# Altium project RFID-project.PrjPcb
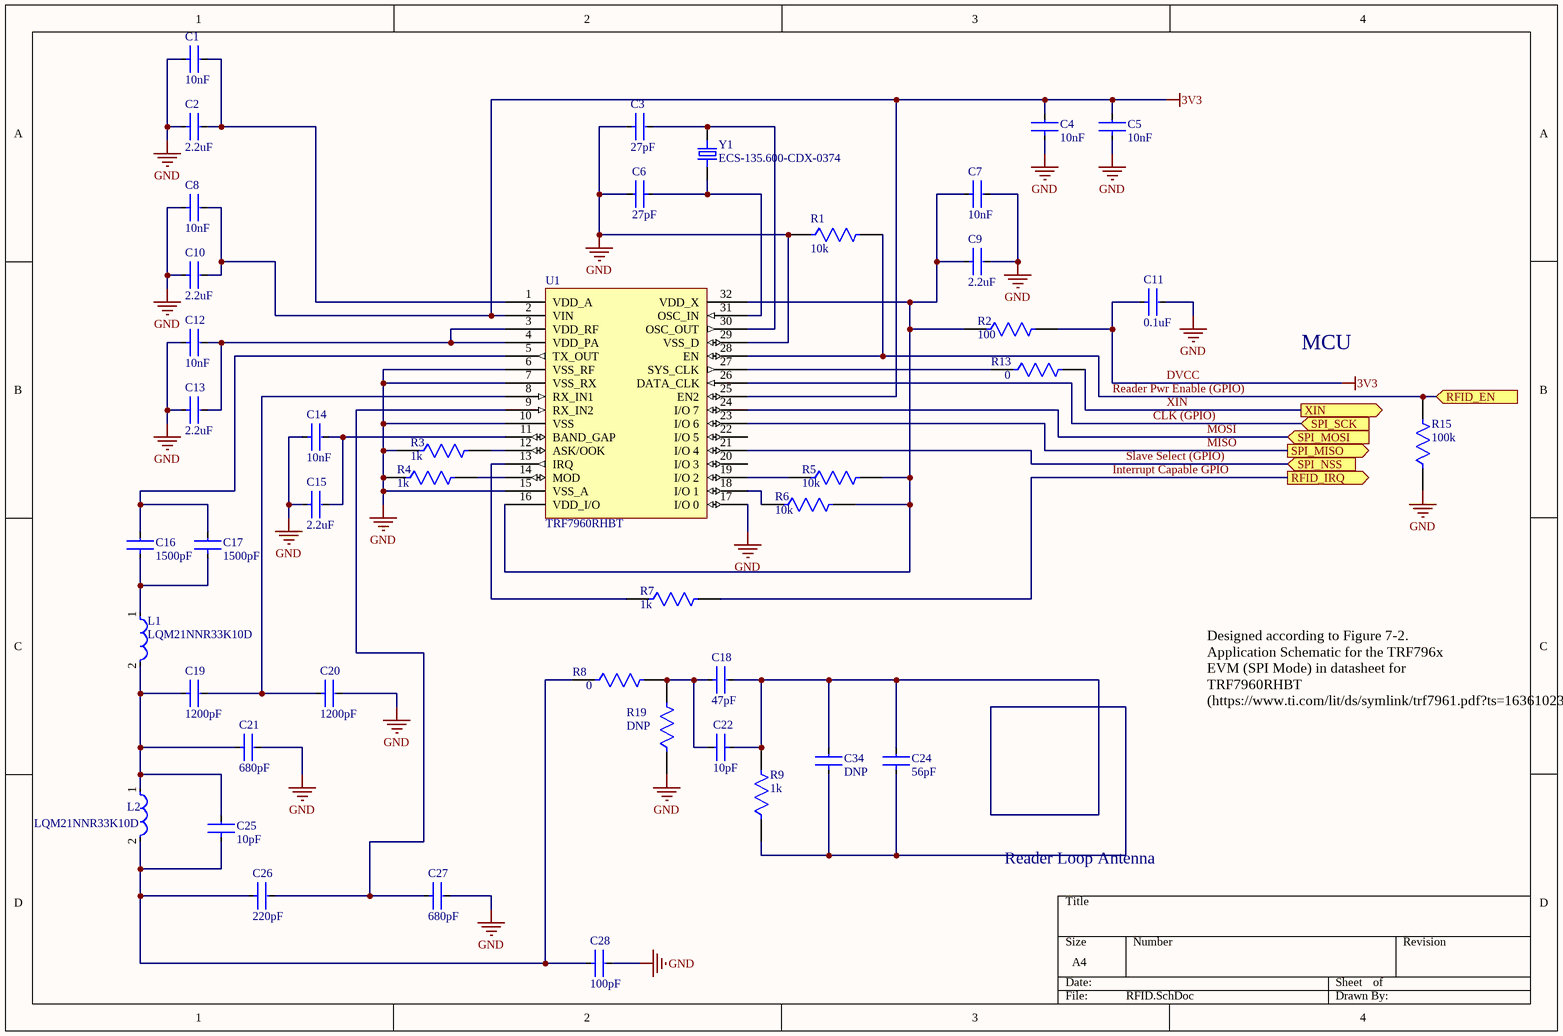
[diagram p0: RFID.SchDoc]
3 sheets, 85 parts. Net scope: flat (ports and power ports of the same name join across sheets).
Board file: RFID-PCB.PcbDoc
Sheets:
  RFID.SchDoc
  MCU.SchDoc
  Power.SchDoc

## Sheet RFID.SchDoc
size A4; SheetNumber: 1; SheetTotal: 3

### Parts
C1  10nF  [FP-GCJ21B-0_3-IPC_A]
C2  2.2uF  [FP-GCJ21B-0_3-IPC_A]
C3  27pF  [FP-GCJ21B-0_3-IPC_A]
C4  10nF  [FP-GCJ21B-0_3-IPC_A]
C5  10nF  [FP-GCJ21B-0_3-IPC_A]
C6  27pF  [FP-GCJ21B-0_3-IPC_A]
C7  10nF  [FP-GCJ21B-0_3-IPC_A]
C8  10nF  [FP-GCJ21B-0_3-IPC_A]
C9  2.2uF  [FP-GCJ21B-0_3-IPC_A]
C10  2.2uF  [FP-GCJ21B-0_3-IPC_A]
C11  0.1uF  [FP-GCJ21B-0_3-IPC_A]
C12  10nF  [FP-GCJ21B-0_3-IPC_A]
C13  2.2uF  [FP-GCJ21B-0_3-IPC_A]
C14  10nF  [FP-GCJ21B-0_3-IPC_A]
C15  2.2uF  [FP-GCJ21B-0_3-IPC_A]
C16  1500pF  [FP-GCJ21B-0_3-IPC_A]
C17  1500pF  [FP-GCJ21B-0_3-IPC_A]
C18  47pF  [FP-GCJ21B-0_3-IPC_A]
C19  1200pF  [FP-GCJ21B-0_3-IPC_A]
C20  1200pF  [FP-GCJ21B-0_3-IPC_A]
C21  680pF  [FP-GCJ21B-0_3-IPC_A]
C22  10pF  [FP-GCJ21B-0_3-IPC_A]
C24  56pF  [FP-GCJ21B-0_3-IPC_A]
C25  10pF  [FP-GCJ21B-0_3-IPC_A]
C26  220pF  [FP-GCJ21B-0_3-IPC_A]
C27  680pF  [FP-GCJ21B-0_3-IPC_A]
C28  100pF  [FP-GCJ21B-0_3-IPC_A]
C34  DNP  [FP-GCJ21B-0_3-IPC_A]
L1  LQM21NNR33K10D  [FP-LQM21DN_00-IPC_A]
L2  LQM21NNR33K10D  [FP-LQM21DN_00-IPC_A]
R1  10k  [FP-AC0603-MFG]
R2  100  [FP-AC0603-MFG]
R3  1k  [FP-AC0603-MFG]
R4  1k  [FP-AC0603-MFG]
R5  10k  [FP-AC0603-MFG]
R6  10k  [FP-AC0603-MFG]
R7  1k  [FP-AC0603-MFG]
R8  0  [FP-AC0603-MFG]
R9  1k  [FP-AC0603-MFG]
R13  0  [FP-AC0603-MFG]
R15  100k  [FP-AC0603-MFG]
R19  DNP  [FP-AC0603-MFG]
U1  TRF7960RHBT  [IC_ADS125H01IRHBT]
Y1  ECS-135.600-CDX-0374  [XTAL_ECS-135.600-CDX-0374]

### Ports
RFID_EN (in), RFID_IRQ (out), SPI_MISO (out), SPI_MOSI (in), SPI_NSS (in), SPI_SCK (in), XIN (out)

### Nets
DVCC: C4.2 C5.2 C8.2 C10.2 C11.1 R2.2 U1.2(VIN) U1.25(EN2)  [also labelled 3V3]
GND: C1.1 C2.1 C3.1 C4.1 C5.1 C6.2 C7.2 C8.1 C9.2 C10.1 C11.2 C12.1 C13.1 C14.1 C15.1 C20.2 C21.2 C27.2 C28.2 R1.1 R3.1 R4.1 R15.1 R19.1 U1.6(VSS_RF) U1.7(VSS_RX) U1.10(VSS) U1.15(VSS_A) U1.17(I/O_0) U1.29(VSS_D)
CLK (GPIO): U1.26(DATA_CLK) ; port SPI_SCK
Interrupt Capable GPIO: R7.2 ; port RFID_IRQ
MISO: U1.23(I/O_6) ; port SPI_MISO
MOSI: U1.24(I/O_7) ; port SPI_MOSI
Reader Pwr Enable (GPIO): R1.2 R15.2 U1.28(EN) ; port RFID_EN
Slave Select (GPIO): U1.21(I/O_4) ; port SPI_NSS
XIN: R13.2 ; port XIN
NetC1_2: C1.2 C2.2 U1.1(VDD_A)
NetC3_2: C3.2 U1.30(OSC_OUT) Y1.2
NetC6_1: C6.1 U1.31(OSC_IN) Y1.1
NetC7_1: C7.1 C9.1 R2.1 R5.2 R6.2 U1.16(VDD_I/O) U1.32(VDD_X)
NetC12_2: C12.2 C13.2 U1.3(VDD_RF) U1.4(VDD_PA)
NetC14_2: C14.2 C15.2 U1.11(BAND_GAP)
NetC16_1: C16.1 C17.1 L1.1
NetC16_2: C16.2 C17.2 U1.5(TX_OUT)
NetC18_1: C18.1 C22.2 R8.2 R19.2
NetC18_2: C18.2 C22.1 C24.1 C24.2 C34.1 C34.2 R9.1 R9.2
NetC19_1: C19.1 C21.1 C25.2 L1.2 L2.1
NetC19_2: C19.2 C20.1 U1.8(RX_IN1)
NetC25_1: C25.1 C26.1 C28.1 L2.2 R8.1
NetC26_2: C26.2 C27.1 U1.9(RX_IN2)
NetR3_2: R3.2 U1.12(ASK/OOK)
NetR4_2: R4.2 U1.14(MOD)
NetR5_1: R5.1 U1.19(I/O_2)
NetR6_1: R6.1 U1.18(I/O_1)
NetR7_1: R7.1 U1.13(IRQ)
NetR13_1: R13.1 U1.27(SYS_CLK)

Not connected (* = marked no-connect by the designer): U1 20(I/O_3) 22(I/O_5)

### Notes on the sheet
- MCU
- Designed according to Figure 7-2. Application Schematic for the TRF796x EVM (SPI Mode) in datasheet for TRF7960RHBT               (https://www.ti.com/lit/ds/symlink/trf7961.pdf?ts=1636102370290&ref_url=https%253A%252F%252Fwww.google.com%252F)
- Reader Loop Antenna

### Library data of the parts
C1-C22 C24-C28 C34 = CMP-2007-03210-2: Multilayer Ceramic Capacitors MLCC - SMD/SMT 0805 2.2uF 10%, 16VDC,  X7R 15%; Voltage Rating (DC): 16V; Thickness: 0.057inch; Lead Free: Lead Free; Dielectric: X7R; Case Code (Imperial): 0805; Packaging: Tape and Reel; Features: Soft Termination; Termination: SMD/SMT; Height: 1.25mm; Radiation Hardening: No; Capacitance: 2.2uF; Package Quantity: 1; Min Operating Temperature: -55°C; Ratings: AEC-Q200; Voltage Rating: 16V; Case/Package: 0805; Max Operating Temperature: 125°C; Depth: 1.25mm; Tolerance: 10%; Case Code (Metric): 2012; Length: 2mm; Mount: Surface Mount; Width: 0.049inch
L1 L2 = CMP-06042-017039-1: Multilayer Type Inductor for General Circuits, 0805 (2012), 0.33μH, 10%, 0.48Ω, 250mA; DC Resistance (DCR): 480mR; Self Resonant Frequency: 180MHz; Q Factor: 20; Core Material: Ferrite; Inductance: 330nH; Shielding: Shielded; Test Frequency: 25MHz; Max DC Current: 250mA; Number of Pins: 2; Mount: Surface Mount; Case/Package: 0805; Case Code (Metric): 2012; Min Operating Temperature: -40°C; Package Quantity: 4000; DC Current: 250mA; Max Operating Temperature: 85°C; Height - Seated (Max): 0.041inch; REACH SVHC: No SVHC; Radiation Hardening: No; Current Rating: 250mA; Length: 2mm; Depth: 1.45mm; Height: 0.85mm; Packaging: Tape and Reel; Inductance Tolerance: 10%; Case Code (Imperial): 0805; Series: LQM21N; Military Standard: Not; Width: 0.049inch; RoHS Compliant: Yes; Termination: SMD/SMT; Tolerance: 10%
R1-R9 R13 R15 R19 = CMP-03412-025180-1: RES SMD 60.4 OHM 1% 1/10W 0603; Manufacturer Part Number: AC0603FR-0760R4L; Manufacturer: Yageo; Automotive Grade: Grade 0; Value: 60.4Ω; Power Rating: 0.1W; Voltage Rating: 75V; Tolerance: 0.01; Automotive: Yes; Category: Res; Mouser Description: Res Thick Film 0603 60.4 Ohm 1% 0.1W(1/10W) ±100ppm/C Epoxy Pad SMD Automotive T/R; Height: 0.55mm; Temperature: -55°C to +155°C; Resistance: 60.4Ω; Package: AC0603; Device Class L3: Chip SMD Resistors; ComponentLink2URL: http://www.yageo.com/NewPortal/yageodocoutput?fileName=/pdf/R-Chip/PYu-AC_51_RoHS_L_6.pdf; Composition: Thick Film; Octopart: https://octopart.com/ac0603fr-0760r4l-yageo-71367350; Temperature Range Low: -55°C; Lead Free: Yes; Footprint Url: http://www.yageo.com/exep/pages/download/literatures/PYu-R_Mount_9.pdf; ComponentLink2Description: Datasheet; Series: AC; Device Class L1: Passive Components; Device Class L2: Resistors; Temperature Range High: +155°C; RoHS: TRUE; Digikey Description: RES SMD 60.4 OHM 1% 1/10W 0603; Ipc Land Pattern Name: RESC16080X45
U1 = TRF7960RHBT: TRF7960 Multi-Protocol Fully Integrated 13.56-MHz RFID Reader/Writer IC 32-VQFN -40 to 110
Y1 = ECS-135.600-CDX-0374: Package: None; Price: None; Value: *; MP: ECS-135.600-CDX-0374; Availability: Unavailable

## Sheet MCU.SchDoc
size A4; SheetNumber: 2; SheetTotal: 3
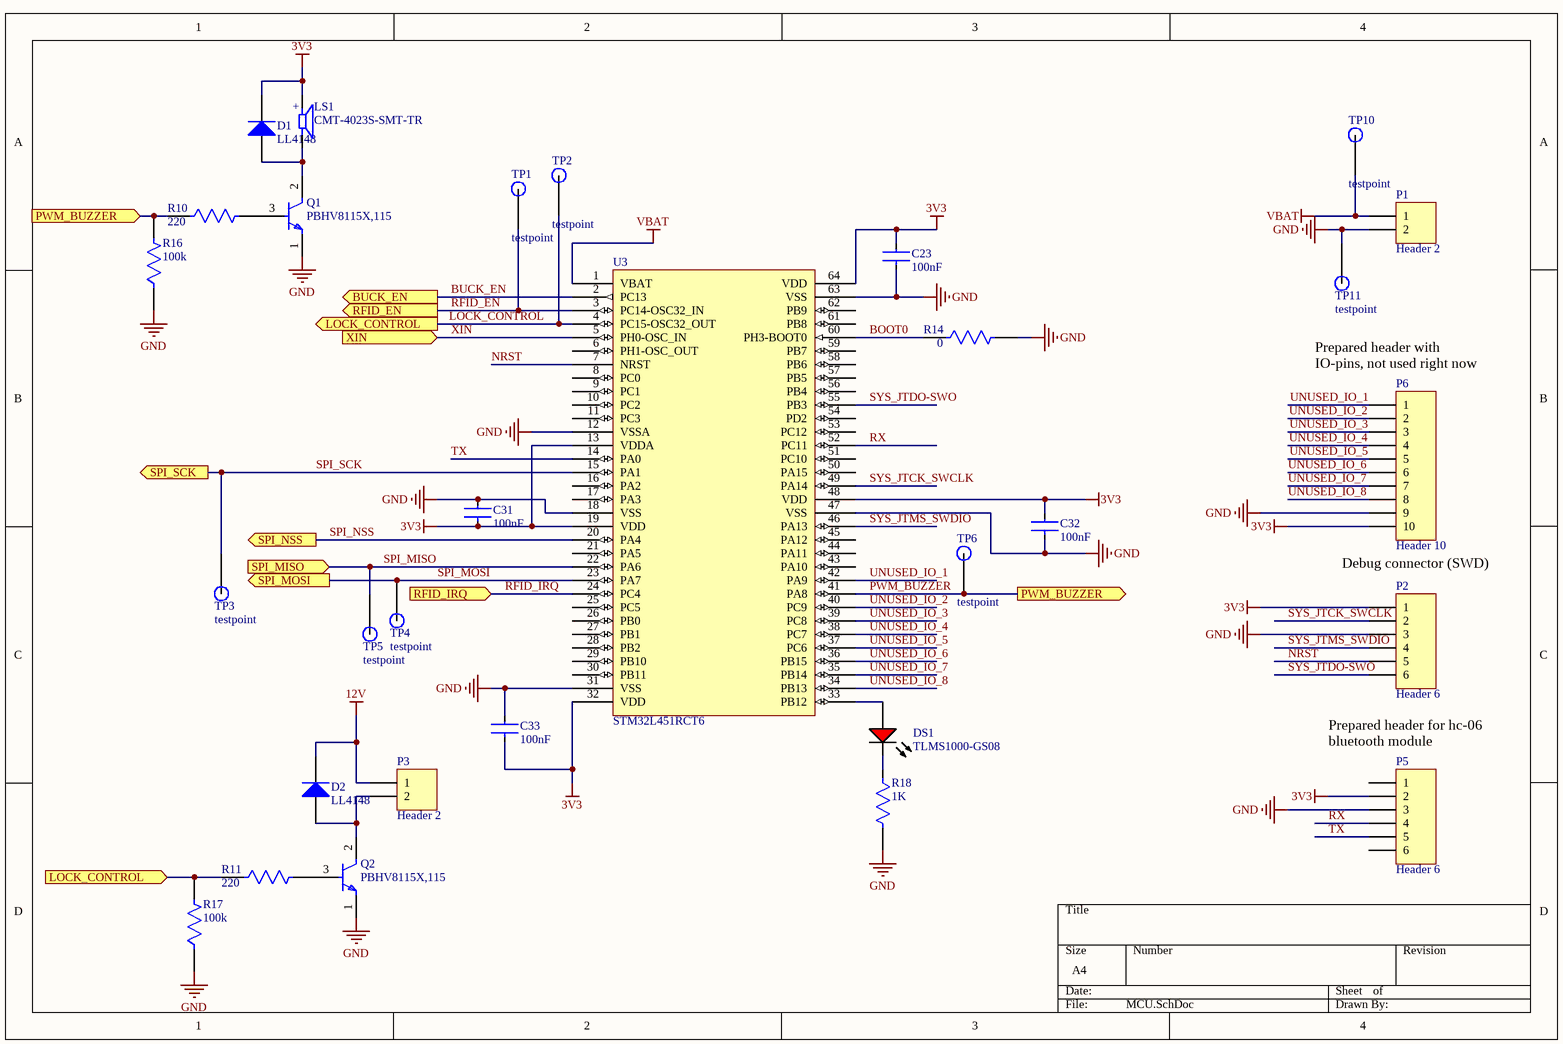
[diagram p1: MCU.SchDoc]

### Parts
C23  100nF  [FP-GCJ21B-0_3-IPC_A]
C31  100nF  [FP-GCJ21B-0_3-IPC_A]
C32  100nF  [FP-GCJ21B-0_3-IPC_A]
C33  100nF  [FP-GCJ21B-0_3-IPC_A]
D1  LL4148  [FAIR-SOD80-2_V]
D2  LL4148  [FAIR-SOD80-2_V]
DS1  TLMS1000-GS08  [VISH-TLMS1000_V]
LS1  CMT-4023S-SMT-TR  [CUI_CMT-4023S-SMT-TR]
P1  Header 2  [HDR1X2]
P2  Header 6  [HDR1X6]
P3  Header 2  [HDR1X2]
P5  Header 6  [HDR1X6]
P6  Header 10  [HDR1X10]
Q1  PBHV8115X,115  [FP-SOT89-MFG]
Q2  PBHV8115X,115  [FP-SOT89-MFG]
R10  220  [FP-AC0603-MFG]
R11  220  [FP-AC0603-MFG]
R14  0  [FP-AC0603-MFG]
R16  100k  [FP-AC0603-MFG]
R17  100k  [FP-AC0603-MFG]
R18  1K  [FP-AC0603-MFG]
TP1  testpoint  [Testpoint]
TP2  testpoint  [Testpoint]
TP3  testpoint  [Testpoint]
TP4  testpoint  [Testpoint]
TP5  testpoint  [Testpoint]
TP6  testpoint  [Testpoint]
TP10  testpoint  [Testpoint]
TP11  testpoint  [Testpoint]
U3  STM32L451RCT6  [LQFP-64]

### Ports
BUCK_EN (out), LOCK_CONTROL (in), LOCK_CONTROL (out), PWM_BUZZER (in), PWM_BUZZER (out), RFID_EN (out), RFID_IRQ (in), SPI_MISO (in), SPI_MOSI (out), SPI_NSS (out), SPI_SCK (out), XIN (in)

### Nets
3V3: C23.2 C31.1 C32.2 C33.1 D1.2(K) LS1.P P2.1 P5.2 P6.10 U3.13(VDDA) U3.19(VDD) U3.32(VDD) U3.48(VDD) U3.64(VDD)  [project net DVCC]
12V: D2.2(K) P3.1
GND: C23.1 C31.2 C32.1 C33.2 P1.2 P2.3 P5.3 P6.9 Q1.1(E) Q2.1(E) R14.2 R16.1 R17.1 R18.2 TP11.1(tp) U3.12(VSSA) U3.18(VSS) U3.31(VSS) U3.47(VSS) U3.63(VSS)
VBAT: P1.1 TP10.1(tp) U3.1(VBAT)
BOOT0: R14.1 U3.60(PH3-BOOT0)
BUCK_EN: U3.2(PC13) ; port BUCK_EN
LOCK_CONTROL: R11.1 R17.2 TP2.1(tp) U3.4(PC15-OSC32_OUT) ; port LOCK_CONTROL
NRST: P2.5 U3.7(NRST)
PWM_BUZZER: R10.1 R16.2 TP6.1(tp) U3.41(PA8) ; port PWM_BUZZER
RFID_EN: TP1.1(tp) U3.3(PC14-OSC32_IN) ; port RFID_EN  [project net Reader Pwr Enable (GPIO)]
RFID_IRQ: U3.24(PC4) ; port RFID_IRQ  [project net Interrupt Capable GPIO]
RX: P5.4 U3.52(PC11)
SPI_MISO: TP5.1(tp) U3.22(PA6) ; port SPI_MISO  [project net MISO]
SPI_MOSI: TP4.1(tp) U3.23(PA7) ; port SPI_MOSI  [project net MOSI]
SPI_NSS: U3.20(PA4) ; port SPI_NSS  [project net Slave Select (GPIO)]
SPI_SCK: TP3.1(tp) U3.15(PA1) ; port SPI_SCK  [project net CLK (GPIO)]
SYS_JTCK_SWCLK: P2.2 U3.49(PA14)
SYS_JTDO-SWO: P2.6 U3.55(PB3)
SYS_JTMS_SWDIO: P2.4 U3.46(PA13)
TX: P5.5 U3.14(PA0)
UNUSED_IO_1: P6.1 U3.42(PA9)
UNUSED_IO_2: P6.2 U3.40(PC9)
UNUSED_IO_3: P6.3 U3.39(PC8)
UNUSED_IO_4: P6.4 U3.38(PC7)
UNUSED_IO_5: P6.5 U3.37(PC6)
UNUSED_IO_6: P6.6 U3.36(PB15)
UNUSED_IO_7: P6.7 U3.35(PB14)
UNUSED_IO_8: P6.8 U3.34(PB13)
XIN: U3.5(PH0-OSC_IN) ; port XIN
NetD1_1: D1.1(A) LS1.N Q1.2(C)
NetD2_1: D2.1(A) P3.2 Q2.2(C)
NetDS1_1: DS1.1(A) U3.33(PB12)
NetDS1_2: DS1.2(K) R18.1
NetQ1_3: Q1.3(B) R10.2
NetQ2_3: Q2.3(B) R11.2

Not connected (* = marked no-connect by the designer): P5 1 6; U3 6(PH1-OSC_OUT) 8(PC0) 9(PC1) 10(PC2) 11(PC3) 16(PA2) 17(PA3) 21(PA5) 25(PC5) 26(PB0) 27(PB1) 28(PB2) 29(PB10) 30(PB11) 43(PA10) 44(PA11) 45(PA12) 50(PA15) 51(PC10) 53(PC12) 54(PD2) 56(PB4) 57(PB5) 58(PB6) 59(PB7) 61(PB8) 62(PB9)

### Notes on the sheet
- (near P6) Prepared header with IO-pins, not used right now
- Debug connector (SWD)
- Prepared header for hc-06 bluetooth module
- (in symbol CMT-4023S-SMT-TR) +

### Library data of the parts
C23 C31-C33 = CMP-2007-03210-2: as C1 on sheet RFID; Thickness: 0.057inch; Lead Free: Lead Free; Dielectric: X7R; Case Code (Imperial): 0805; Packaging: Tape and Reel; Features: Soft Termination; Termination: SMD/SMT; Height: 1.25mm; Radiation Hardening: No; Capacitance: 2.2uF; Package Quantity: 1; Min Operating Temperature: -55°C; Ratings: AEC-Q200; Voltage Rating: 16V; Case/Package: 0805; Max Operating Temperature: 125°C; Depth: 1.25mm; Tolerance: 10%; Case Code (Metric): 2012; Length: 2mm; Mount: Surface Mount; Width: 0.049inch
D1 D2 = CMP-2000-05115-2: Small Signal Diode, 100 V, 0.2 A, -55 to 175 degC, 2-Pin SOD80, RoHS, Tape and Reel; Manufacturer: Fairchild; Reverse Voltage-Max [Vrrm]: 100V; Average Forward Current-Max: 200mA; Forward Voltage: 1V; Reverse Recovery Time-Max: 1ns; Power Dissipation: 500mW; Datasheet URL: https://www.fairchildsemi.com/datasheets/LL/LL4148.pdf; Manufacturer URL: https://www.fairchildsemi.com/; Datasheet Version: Rev. 1.8, 01/2016
DS1 = CMP-2000-07254-1: Low Current LED, 40 mW, 1.8 V, -40 to 100 degC, 2-Pin SMD (0603), RoHS, Tape and Reel; Manufacturer: Vishay; Lens Shape: Rectangular; Automotive Qualification Standard: AEC-Q100; Wavelength Typ: 636nm; SVHC: ToBeAdvised; LED Colour: Red; Bulb Size: 1.6mmx0.8mm; Forward Voltage: 1.8V; Luminous Intensity: 4mcd; Forward Current If: 2mA; Viewing Angle: 80°; Datasheet Version: Rev. 1.7, 02/2011; Datasheet URL: https://datasheet.ciiva.com/5798/1698881-5798337.pdf; LED Mounting: SMD; Packaging: CutTape; Package Reference: TLMS1000; Manufacturer URL: http://www.vishay.com/; Mounting Technology: SurfaceMount; Product Range: -; Package Description: 2-Pin Surface Mount Device, Body 1.6 x 0.8 mm; MSL: MSL2-1year
LS1 = CMT-4023S-SMT-TR: 4 mm, 3 Vo-p, 70 dB, Surface Mount _SMT_, Magnetic Audio Transducer Buzzer; MF: CUI Devices; Value: *; Availability: Unavailable; Package: SIP-1 CUI; Price: None; SnapEDA_Link: https://www.snapeda.com/parts/CMT-4023S-SMT-TR/CUI%20Devices/view-part/612102/?ref=snap; MP: CMT-4023S-SMT-TR; CUI_purchase_URL: https://www.cuidevices.com/product/audio/buzzers/audio-transducers/cmt-4023s-smt-tr?utm_source=snapeda.com&utm_medium=referral&utm_campaign=snapedaBOM
P1 P3 = Header 2: Header, 2-Pin; LatestRevisionDate: 17-Jul-2002; LatestRevisionNote: Re-released for DXP Platform.; Publisher: Altium Limited
P2 P5 = Header 6: Header, 6-Pin; LatestRevisionDate: 17-Jul-2002; LatestRevisionNote: Re-released for DXP Platform.; Publisher: Altium Limited
P6 = Header 10: Header, 10-Pin; LatestRevisionDate: 17-Jul-2002; LatestRevisionNote: Re-released for DXP Platform.; Publisher: Altium Limited
Q1 Q2 = CMP-14406-000018-1: TRANS NPN 150V 1A SOT89; Manufacturer: Nexperia; Number Of Npn: 1; Rise Time Tr: 565ns; Delay Time Td: 7ns; Rthja Max: 240K/W; Emitter Base Voltage: 6V; Hfe Testvce: 10V; Collector Emitter Saturation Voltage: 33mV; Hfe Min: 10; Max Junction Temp: +150°C; Gain Bandwidth Product: 30MHz; Automotive Grade: Grade 0; Power Dissipation: 0.52W; Collector Base Voltage: 400V; Fall Time Tf: 700ns; Category: Trans; Lead Free: Yes; Number Of Elements: 1; Ambient Temperature Range Low: -55°C; Height: 1.6mm; Temperature: to +150°C; Max Collector Current: 1A; Manufacturer Part Number: PBHV8115X,115; Device Class L3: BJTs; ComponentLink2URL: https://assets.nexperia.com/documents/data-sheet/PBHV8115X.pdf; Collector Emitter Voltage: 150V; Device Class L1: Discrete Semiconductors; Package: SOT89; Storage Time Ts: 1530ns; Ambient Temperature Range High: +150°C; Digikey Description: TRANS NPN 150V 1A SOT89; ComponentLink2Description: Datasheet; Footprint Url: https://assets.nexperia.com/documents/outline-drawing/SOT89.pdf; Device Class L2: Transistors; RoHS: TRUE; Automotive: Yes; Temperature Range High: +150°C; Octopart: https://octopart.com/pbhv8115x%2C115-nexperia-78740688; Hfe Testic: 1A
R10 R11 R14 R16-R18 = CMP-03412-025180-1: as R1 on sheet RFID; Automotive: Yes; Category: Res; Mouser Description: Res Thick Film 0603 60.4 Ohm 1% 0.1W(1/10W) ±100ppm/C Epoxy Pad SMD Automotive T/R; Height: 0.55mm; Temperature: -55°C to +155°C; Resistance: 60.4Ω; Package: AC0603; Device Class L3: Chip SMD Resistors; ComponentLink2URL: http://www.yageo.com/NewPortal/yageodocoutput?fileName=/pdf/R-Chip/PYu-AC_51_RoHS_L_6.pdf; Composition: Thick Film; Octopart: https://octopart.com/ac0603fr-0760r4l-yageo-71367350; Temperature Range Low: -55°C; Lead Free: Yes; Footprint Url: http://www.yageo.com/exep/pages/download/literatures/PYu-R_Mount_9.pdf; ComponentLink2Description: Datasheet; Series: AC; Device Class L1: Passive Components; Device Class L2: Resistors; Temperature Range High: +155°C; RoHS: TRUE; Digikey Description: RES SMD 60.4 OHM 1% 1/10W 0603; Ipc Land Pattern Name: RESC16080X45
U3 = STM32L451RCT6: MCU 32-bit STM32; Manufacturer: STMicroelectronics; Manufacturer Part Number: STM32L451RCT6; RoHS: Yes; Category: Microcontrollers

## Sheet Power.SchDoc
size A4; SheetNumber: 3; SheetTotal: 3
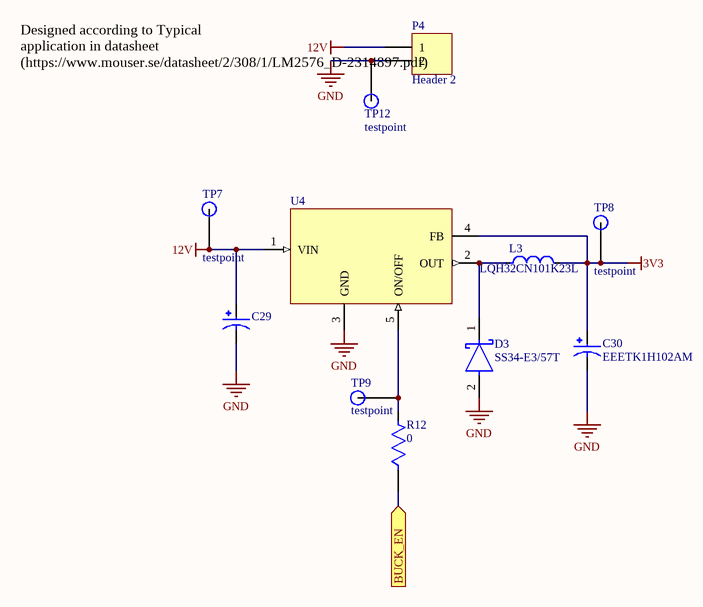
[diagram p2: Power.SchDoc]

### Parts
C29  EEETC1C101P  [CAP_EEETC1C101P]  (value not drawn)
C30  EEETK1H102AM  [CAP_EEETK1H102AM]
D3  SS34-E3/57T  [FP-95402-MFG]
L3  LQH32CN101K23L  [FP-LQH32CH_23-MFG]
P4  Header 2  [HDR1X2]
R12  0  [FP-AC0603-MFG]
TP7  testpoint  [Testpoint]
TP8  testpoint  [Testpoint]
TP9  testpoint  [Testpoint]
TP12  testpoint  [Testpoint]
U4  LM2576D2TR4-3.3G  [D2PAK-5]  (value not drawn)

### Ports
BUCK_EN (in)

### Nets
3V3: C30.1 L3.2 TP8.1(tp) U4.4(FB)  [project net DVCC]
12V: C29.1 P4.1 TP7.1(tp) U4.1(VIN)
GND: C29.2 C30.2 D3.2(A) P4.2 TP12.1(tp) U4.3(GND)
BUCK_EN: R12.1 ; port BUCK_EN
NetD3_1: D3.1(C) L3.1 U4.2(OUT)
NetR12_2: R12.2 TP9.1(tp) U4.5(ON/OFF)

### Notes on the sheet
- Designed according to Typical application in datasheet (https://www.mouser.se/datasheet/2/308/1/LM2576_D-2314897.pdf)

### Library data of the parts
C29 = EEETC1C101P: 100µF 16V Aluminum Electrolytic Capacitors Radial, Can - SMD 200mOhm @ 100kHz 3000 Hrs @ 125°C; MF: Panasonic; MP: EEETC1C101P; Package: RADIAL-2 Panasonic; Availability: In Stock; Value: *; SnapEDA_Link: https://www.snapeda.com/parts/EEETC1C101P/Panasonic/view-part/?ref=snap; Price: None; Check_prices: https://www.snapeda.com/parts/EEETC1C101P/Panasonic/view-part/?ref=eda
C30 = EEETK1H102AM: 1000µF 50V Aluminum Electrolytic Capacitors Radial, Can - SMD 140mOhm @ 100kHz 2000 Hrs @ 125°C; MF: Panasonic Electronic; MP: EEE-TK1H102AM; Availability: In Stock; Price: None; Package: RADIAL-2 Panasonic; SnapEDA_Link: https://www.snapeda.com/parts/EEE-TK1H102AM/Panasonic%20Electronic%20Components/view-part/2193516/?ref=snap; Value: *; Check_prices: https://www.snapeda.com/parts/EEE-TK1H102AM/Panasonic%20Electronic%20Components/view-part/2193516/?ref=eda; Purchase-URL: https://pricing.snapeda.com/search/part/EEE-TK1H102AM/?ref=eda
D3 = CMP-02539-000012-1: DIODE SCHOTTKY 40V 3A DO214AB; Manufacturer: Vishay; Max Junction Temp: +150°C; Peak Reverse Current: 0.5mA; Max Surge Forward Current: 100A; Standoff Height: 0mm; ComponentLink2Description: Datasheet; Device Class L3: Schottky Diodes; Height: 2.62mm; Max Repetitive Reverse Voltage: 40V; Lead Free: Yes; Package: 95402; Temperature Range High: +150°C; ComponentLink2URL: http://www.vishay.com/docs/88751/ss32.pdf; Temperature: -55°C to +150°C; Footprint Url: http://www.vishay.com/docs/95402/smc.pdf; Automotive: No; Forward Current: 3A; Category: Diode; Manufacturer Part Number: SS34-E3/57T; RoHS: TRUE; Device Class L2: Diodes; Mouser Description: Schottky Diodes & Rectifiers 3.0 Amp 40 Volt; Octopart: https://octopart.com/ss34-e3%2F57t-vishay-39552907; Temperature Range Low: -55°C; Device Class L1: Discrete Semiconductors; Digikey Description: DIODE SCHOTTKY 40V 3A DO214AB
L3 = CMP-06042-006648-2: Wire Wound Ferrite Inductor for Power Lines 100μH ±10% 4.55Ω 100mA 1210; Q Factor: 40; Current: 1.1A; Self Resonant Frequency: 10MHz; Shielding: Unshielded; DC Resistance (DCR): 3.5R; Test Frequency: 1MHz; Inductance: 100uH; Case Code (Imperial): 1210; Lead Free: Lead Free; Military Standard: Not; Mount: Surface Mount; REACH SVHC: No SVHC; Max Operating Temperature: 85°C; DC Current: 100mA; Weight: 0.002116oz; Radiation Hardening: No; Inductance Tolerance: 10%; Number of Pins: 2; Packaging: Tape and Reel; Rated Current-Max: 100mA; Termination: SMD/SMT; Max DC Current: 100mA; Current Rating: 100mA; Width: 2.5mm; Height: 2mm; Core Material: Ferrite; RoHS Compliant: Yes; Frequency: 10MHz; Package Quantity: 2000; Series: LQH32C_33; Case/Package: 1210; Length: 3.2mm; Tolerance: 10%; Min Operating Temperature: -40°C; Case Code (Metric): 3225; Depth: 2.7mm; Inductor Type: Wirewound
P4 = Header 2: Header, 2-Pin; LatestRevisionDate: 17-Jul-2002; LatestRevisionNote: Re-released for DXP Platform.; Publisher: Altium Limited
R12 = CMP-03412-025180-1: as R1 on sheet RFID; Automotive: Yes; Category: Res; Mouser Description: Res Thick Film 0603 60.4 Ohm 1% 0.1W(1/10W) ±100ppm/C Epoxy Pad SMD Automotive T/R; Height: 0.55mm; Temperature: -55°C to +155°C; Resistance: 60.4Ω; Package: AC0603; Device Class L3: Chip SMD Resistors; ComponentLink2URL: http://www.yageo.com/NewPortal/yageodocoutput?fileName=/pdf/R-Chip/PYu-AC_51_RoHS_L_6.pdf; Composition: Thick Film; Octopart: https://octopart.com/ac0603fr-0760r4l-yageo-71367350; Temperature Range Low: -55°C; Lead Free: Yes; Footprint Url: http://www.yageo.com/exep/pages/download/literatures/PYu-R_Mount_9.pdf; ComponentLink2Description: Datasheet; Series: AC; Device Class L1: Passive Components; Device Class L2: Resistors; Temperature Range High: +155°C; RoHS: TRUE; Digikey Description: RES SMD 60.4 OHM 1% 1/10W 0603; Ipc Land Pattern Name: RESC16080X45
U4 = LM2576D2TR4-3.3G: http://octopart.com/lm2576d2tr4-5g-on+semiconductor-46514222; Package: None; Price: None; Value: *; MP: LM2576D2TR4-3.3G; Availability: Unavailable

## Nets that join several sheets
12V: MCU (D2.2 P3.1), Power (C29.1 P4.1 TP7.1 U4.1)
DVCC: RFID (8 pins), MCU (14 pins), Power (C30.1 L3.2 TP8.1 U4.4)
GND: RFID (30 pins), MCU (20 pins), Power (6 pins)
BUCK_EN: MCU (U3.2), Power (R12.1)
CLK (GPIO): RFID (U1.26), MCU (TP3.1 U3.15)
Interrupt Capable GPIO: RFID (R7.2), MCU (U3.24)
MISO: RFID (U1.23), MCU (TP5.1 U3.22)
MOSI: RFID (U1.24), MCU (TP4.1 U3.23)
Reader Pwr Enable (GPIO): RFID (R1.2 R15.2 U1.28), MCU (TP1.1 U3.3)
Slave Select (GPIO): RFID (U1.21), MCU (U3.20)
XIN: RFID (R13.2), MCU (U3.5)